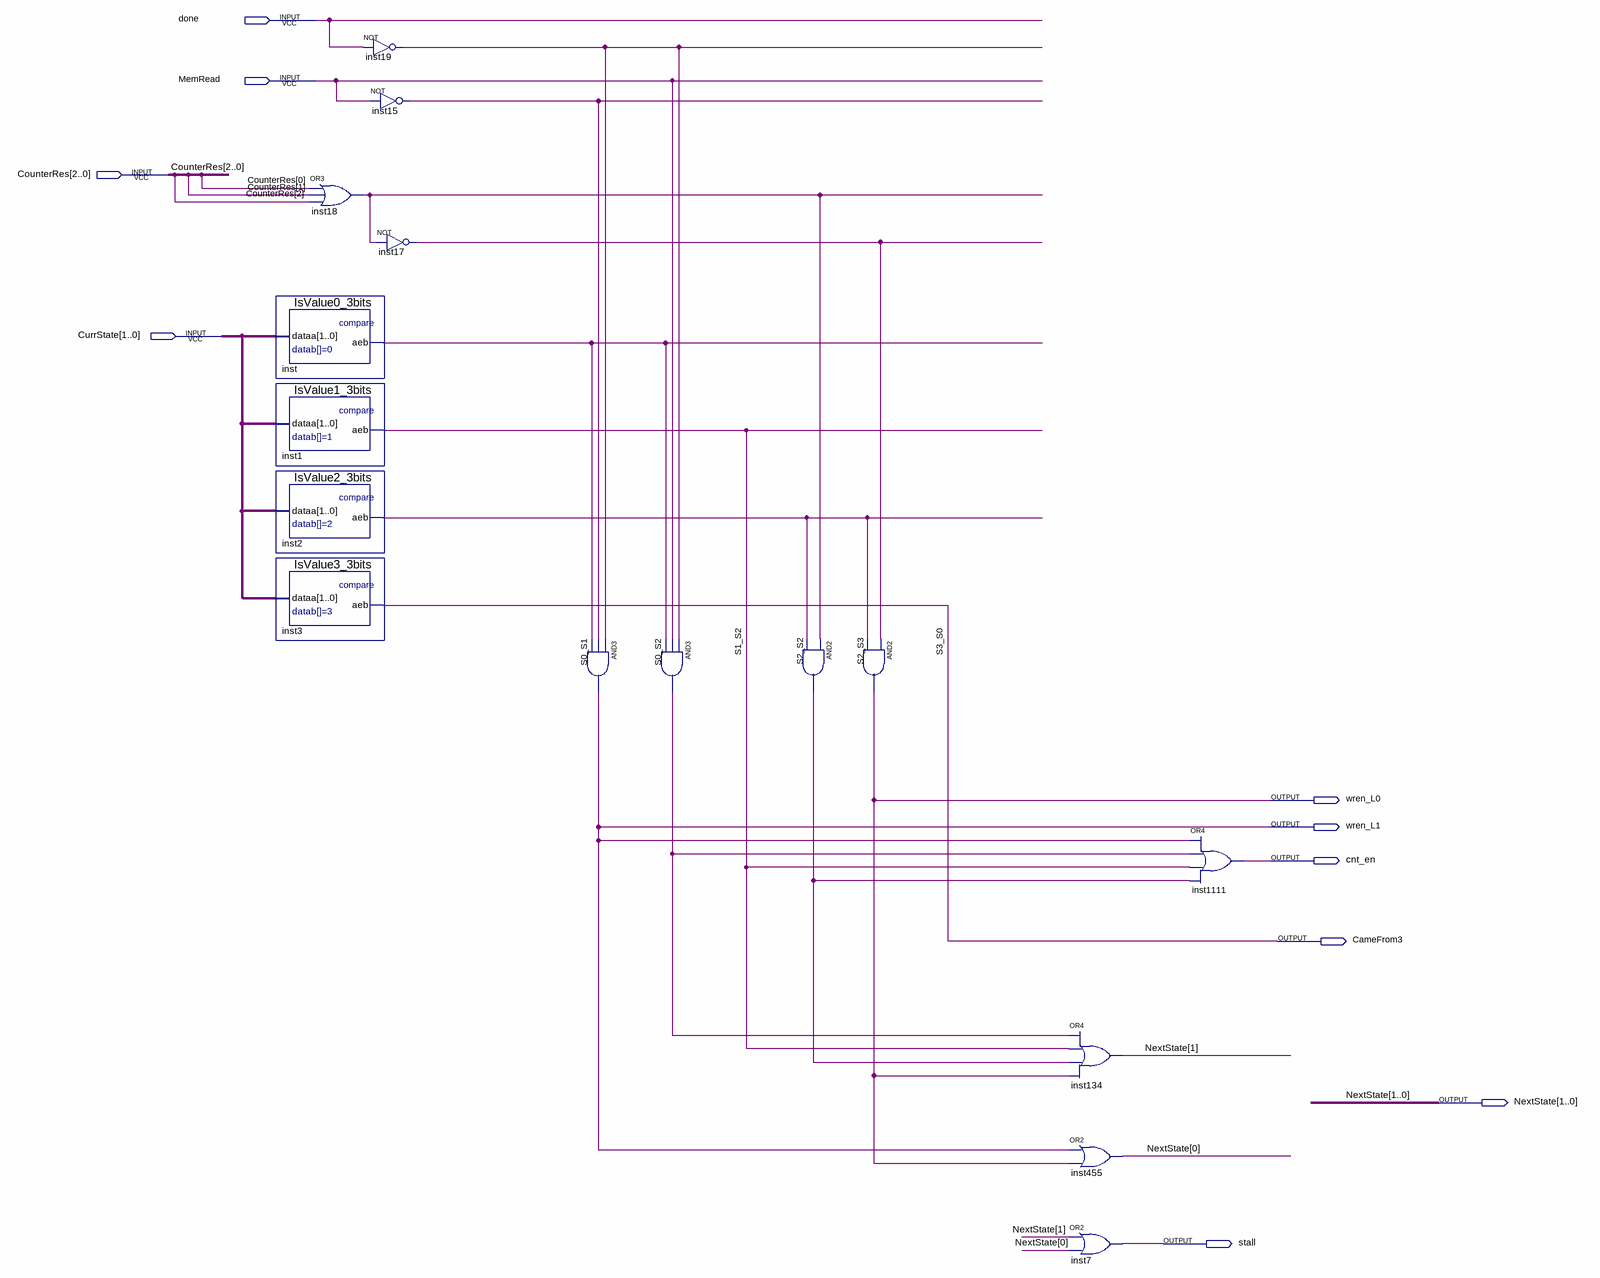
[diagram p0: schematic sheet]
// Quartus schematic NewMemoryControl.bdf as structural Verilog: 16 symbols, 10 pins
module NewMemoryControl (
  input  done,
  input  MemRead,
  input  [2:0] CounterRes,
  input  [1:0] CurrState,
  output wren_L0,
  output wren_L1,
  output cnt_en,
  output CameFrom3,
  output [1:0] NextState,
  output stall
);

  wire inst2_aeb, inst15_out, inst17_out, inst18_out, inst19_out, inst_aeb, S0_S2_out, S1_S2, S2_S2_out;

  or inst18 (inst18_out, CounterRes[0], CounterRes[1], CounterRes[2]);
  IsValue0_3bits inst (.dataa(CurrState), .aeb(inst_aeb));
  IsValue1_3bits inst1 (.dataa(CurrState), .aeb(S1_S2));
  IsValue2_3bits inst2 (.dataa(CurrState), .aeb(inst2_aeb));
  IsValue3_3bits inst3 (.dataa(CurrState), .aeb(CameFrom3));
  not inst19 (inst19_out, done);
  not inst15 (inst15_out, MemRead);
  not inst17 (inst17_out, inst18_out);
  and S0_S1 (wren_L1, inst19_out, inst15_out, inst_aeb);
  and S0_S2 (S0_S2_out, inst19_out, MemRead, inst_aeb);
  and S2_S2 (S2_S2_out, inst18_out, inst2_aeb);
  and S2_S3 (wren_L0, inst17_out, inst2_aeb);
  or inst134 (NextState[1], S0_S2_out, S1_S2, S2_S2_out, wren_L0);
  or inst455 (NextState[0], wren_L1, wren_L0);
  or inst7 (stall, NextState[1], NextState[0]);
  or inst1111 (cnt_en, wren_L1, S0_S2_out, S1_S2, S2_S2_out);

  // Other names for the same wires on the sheet: S3_S0 = CameFrom3
endmodule
